# EAGLE design samd11-usb-test (EAGLE 7.3.0)
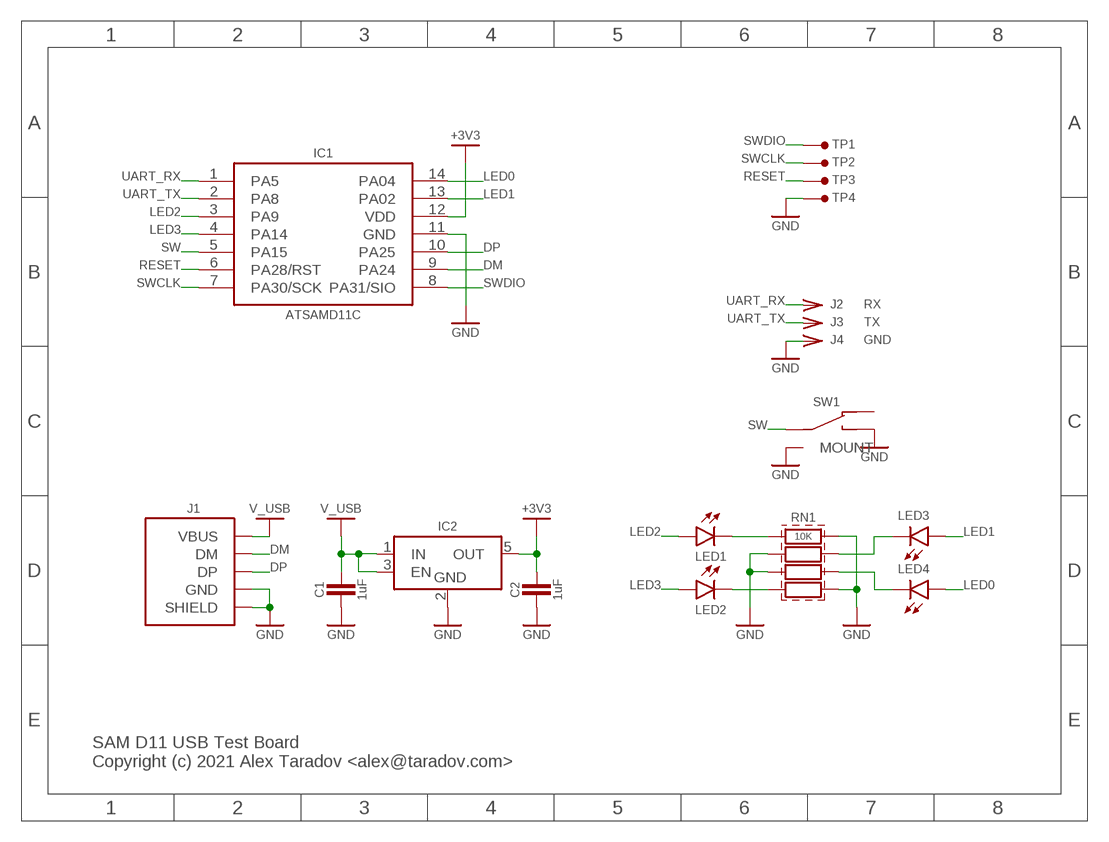
[diagram p0: schematic, sheet 1]

## Parts
C1  1uF  C-0603  [SMD0603]
C2  1uF  C-0603  [SMD0603]
IC1  ATSAMD11C  [SO-14]
IC2  MIC5504-SOT23-5  [SOT23-5]
J1  USB-A-PLUG-TH-NM  [USB-A-PLUG-TH-NM]
J2  RX  CONN-SINGLE-TH  [PIN-TH]
J3  TX  CONN-SINGLE-TH  [PIN-TH]
J4  GND  CONN-SINGLE-TH  [PIN-TH]
LED1  LED_SMDLED_0603  [SMD0603]
LED2  LED_SMDLED_0603  [SMD0603]
LED3  LED_SMDLED_0603  [SMD0603]
LED4  LED_SMDLED_0603  [SMD0603]
RN1  10K  RN-4-0603-X4  [SMD0603-X4]
SW1  SPDT_SWITCH-MOUNT-SMD-MOUNT-NO-HOLES  [SPDT-SMD-5MM-NO-HOLES]
TP1  TEST-POINT-1.27MM-TH  [TP-1.27MM-TH]
TP2  TEST-POINT-1.27MM-TH  [TP-1.27MM-TH]
TP3  TEST-POINT-1.27MM-TH  [TP-1.27MM-TH]
TP4  TEST-POINT-1.27MM-TH  [TP-1.27MM-TH]

## Nets
+3V3: C2.2 IC1.12(VDD) IC2.5(OUT)
DM: IC1.9(PA24) J1.2(DM)
DP: IC1.10(PA25) J1.3(DP)
GND: C1.1 C2.1 IC1.11(GND) IC2.2(GND) J1.4(GND) J1.M1(SHIELD) J1.M2(SHIELD) J4.1 RN1.2 RN1.3 RN1.5 RN1.8 SW1.B SW1.M0(MOUNT) SW1.M1(MOUNT) SW1.M2(MOUNT) SW1.M3(MOUNT) TP4.1
LED0: IC1.14(PA04) LED4.1(A)
LED1: IC1.13(PA02) LED3.1(A)
LED2: IC1.3(PA9) LED1.1(A)
LED3: IC1.4(PA14) LED2.1(A)
N$1: LED2.2(C) RN1.4
N$2: LED1.2(C) RN1.1
N$3: LED3.2(C) RN1.7
N$4: LED4.2(C) RN1.6
RESET: IC1.6(PA28/RST) TP3.1
SW: IC1.5(PA15) SW1.C
SWCLK: IC1.7(PA30/SCK) TP2.1
SWDIO: IC1.8(PA31/SIO) TP1.1
UART_RX: IC1.1(PA5) J2.1
UART_TX: IC1.2(PA8) J3.1
V_USB: C1.2 IC2.1(IN) IC2.3(EN) J1.1(VBUS)
Unconnected: SW1.A

## Notes on the sheet
- SAM D11 USB Test Board
  Copyright (c) 2021 Alex Taradov <alex@taradov.com>

## Library data of the parts
C1 C2 = ataradov_rlc:C
IC1 = ataradov_mcu:ATSAMD11C
IC2 = ataradov_vreg:MIC5504: LM1117 voltage regulator
J1 = ataradov_conn:USB-A-PLUG
J2-J4 = ataradov_conn:CONN-SINGLE
LED1-LED4 = ataradov_led:LED_SMD: SMD_LED
RN1 = ataradov_rlc:RN-4
SW1 = ataradov_switch:SPDT_SWITCH-MOUNT
TP1-TP4 = ataradov_misc:TEST-POINT: Test Point

## Board
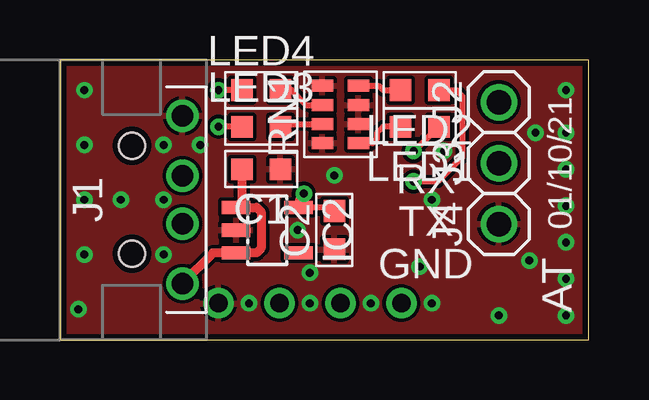
[diagram p1: board, top side]
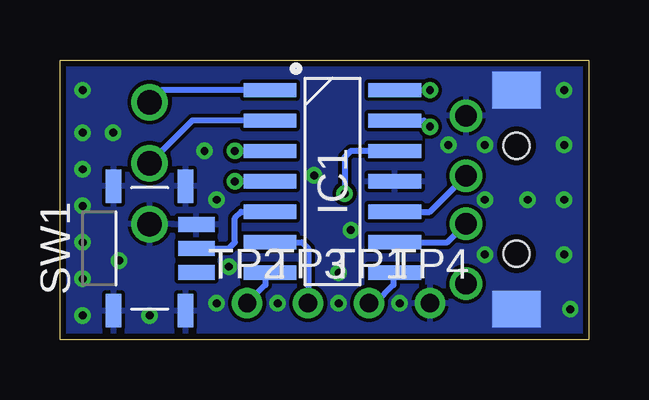
[diagram p2: board, bottom side, seen from below]

Size 22.02 x 11.67 mm. Coordinates in mm from the lower left corner, seen from the top.
Outline: 0,0 22.02,0 22.02,11.67 0,11.67 0,0
Copper layers (1*16): Top 0.0356mm / dielectric 1.5011mm / Bottom 0.0356mm
Design rules "std-tented-new": minimum track width 8mil, minimum drill 13mil, track to track 6mil, track to pad 6mil, pad to pad 6mil, via to via 6mil, smd to smd 0mil, copper to edge 10mil, drill to drill 6mil, minimum pad ring 7mil, minimum via ring 7mil, stop-mask expansion 3mil, vias tented up to drill 25mil, thermal gap 6mil

### Footprints (pad centres in the part's own frame; a part is rotated, then mirrored left to right if it is on the bottom)
SMD0603 = smd 0.9 x 0.9: 1 -0.8,0; 2 0.8,0
SO-14 = smd 0.6 x 2.2: 1 -3.81,-2.6; 2 -2.54,-2.6; 3 -1.27,-2.6; 4 0,-2.6; 5 1.27,-2.6; 6 2.54,-2.6; 7 3.81,-2.6; 8 3.81,2.6; 9 2.54,2.6; 10 1.27,2.6; 11 0,2.6; 12 -1.27,2.6; 13 -2.54,2.6; 14 -3.81,2.6
SOT23-5 = smd 0.55 x 1.2: 1 -0.95,-1.3; 2 0,-1.3; 3 0.95,-1.3; 4 0.95,1.3; 5 -0.95,1.3
USB-A-PLUG-TH-NM = drill 0.9: 1 3.5,5.1; 2 1,5.1; 3 -1,5.1; 4 -3.5,5.1 | smd 1.524 x 2.032 bottom: M1 -4.572,3; M2 4.572,3 | hole 1.1: -2.25,3; 2.25,3
PIN-TH = drill 1.016: 1 0,0
SMD0603-X4 = smd 0.5 x 0.889: 1 -1.2,-0.752; 2 -0.4,-0.752; 3 0.4,-0.752; 4 1.2,-0.752; 5 1.2,0.752; 6 0.4,0.752; 7 -0.4,0.752; 8 -1.2,0.752
SPDT-SMD-5MM-NO-HOLES = smd 0.635 x 1.524: A -1,-1.95; B 1,-1.95; C 0,-1.95 | smd 1.397 x 0.635: M0 -2.6,-1.5; M1 2.6,-1.5; M2 -2.6,1.5; M3 2.6,1.5
TP-1.27MM-TH = drill 0.762 pad 1.27: 1 0,0

### Placement (x,y rotation side)
C1  8.38,7.11 180 top
C2  11.43,4.57 90 top
IC1  10.67,6.6 270 bottom
IC2  8.64,4.57 270 top
J1  0,5.84 270 top
J2  18.29,9.91 90 top
J3  18.29,7.37 90 top
J4  18.29,4.83 90 top
LED1  14.99,8.89 180 top
LED2  14.99,10.41 180 top
LED3  8.38,8.89 0 top
LED4  8.38,10.41 0 top
RN1  11.68,9.4 90 top
SW1  18.29,3.81 90 bottom
TP1  9.14,1.52 0 bottom
TP2  14.22,1.52 0 bottom
TP3  11.68,1.52 0 bottom
TP4  6.6,1.52 0 bottom

### Tracks (layer width: path | path; a pad name or v marks a point on that pad's centre or on a via)
+3V3  (via drill 0.33)
  Top 0.254: IC2.5 9.94,5.87 v10.16,6.1 | 9.96,5.55 IC2.5 | C2.2 11.28,5.52 IC2.5
  Bottom 0.254: IC1.12 9.91,7.87 10.16,7.62 v10.16,6.1
DM
  Bottom 0.254: IC1.9 5.88,4.06 J1.2
DP
  Bottom 0.254: IC1.10 6.61,5.33 J1.3
GND  (via drill 0.33)
  other vias: 2.54,5.84 5.84,8.13 4.32,8.13 4.32,5.84 4.32,3.56 1.02,3.56 1.02,5.84 1.02,8.13 1.02,10.41 0.76,1.27 19.81,8.64 21.08,10.41 21.08,8.64 21.08,1.02 19.56,3.3 18.29,1.02 9.91,4.57 21.08,7.11 21.08,2.54 21.08,4.06 21.08,5.59 15.49,5.84 16,7.87 10.41,2.79 12.95,1.52 10.41,1.52 7.87,1.52 15.49,1.52 11.43,6.86 14.99,3.05
  pour Bottom (isolate 0.152): 0,11.68 22.1,11.68 22.1,0 0,0
  pour Top (isolate 0.152): 0,11.68 22.1,11.68 22.1,0 0,0
LED0  (via drill 0.33)
  Top 0.254: LED4.1 v6.6,10.41
  Bottom 0.254: IC1.14 v6.6,10.41
LED1  (via drill 0.33)
  Top 0.254: LED3.1 v6.6,8.89
  Bottom 0.254: IC1.13 6.86,9.14 v6.6,8.89
LED2  (via drill 0.33)
  Top 0.254: LED1.1 14.77,7.87 v14.73,7.87
  Bottom 0.254: IC1.3 v14.73,7.87
LED3  (via drill 0.33)
  Top 0.254: LED2.1 16.51,10.41 16.76,10.16 16.76,7.62 15.75,6.6 v14.73,6.6
  Bottom 0.254: IC1.4 v14.73,6.6
N$1
  Top 0.254: RN1.4 13.28,10.6 13.46,10.41 LED2.2
N$2
  Top 0.254: LED1.2 13.46,8.89 13.21,8.64 13.21,8.38 13.02,8.2 RN1.1
N$3
  Top 0.254: LED3.2 9.29,9 RN1.7
N$4
  Top 0.254: RN1.6 10.27,9.8 9.65,10.41 LED4.2
RESET
  Bottom 0.254: IC1.6 11.94,4.06 11.68,3.81 TP3.1
SW
  Bottom 0.254: SW1.C 14.99,3.81 14.73,4.06 14.73,5.08 14.48,5.33 IC1.5
SWCLK
  Bottom 0.254: IC1.7 13.46,2.6 13.46,2.29 TP2.1
SWDIO
  Bottom 0.254: IC1.8 8.13,2.73 8.13,2.29 8.89,1.52 TP1.1
UART_RX
  Bottom 0.254: IC1.1 17.78,10.41 J2.1
UART_TX
  Bottom 0.254: IC1.2 16.51,9.14 J3.1
V_USB
  Top 0.381: J1.1 6.38,3.62 IC2.3 8.19,3.62 8.38,3.81 8.38,5.33 8.19,5.52 IC2.1 7.58,5.77 C1.2

### Text on the board
tPlace: 01/10/21 | AT